# EAGLE schematic duende (EAGLE 7.3.0)
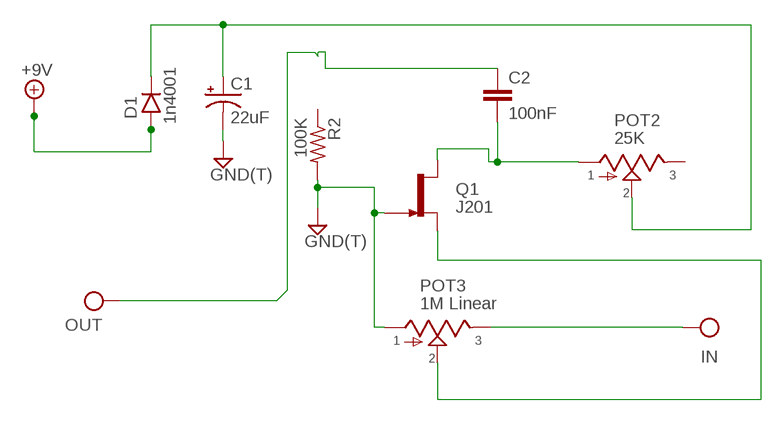
[diagram p0: schematic, sheet 1]

## Parts
+9V  +9V  +9V(T)  [SQUARE]
C1  22uF  050  [050_020]
C2  100nF  070X0302  [070X030]
D1  1n4001  DO41.1  [DO41-1]
GND1  GND(T)  [SQUARE]
GND2  GND(T)  [SQUARE]
IN  IN(T)  [SQUARE]
OUT  OUT(T)  [SQUARE]
POT2  25K  POTTRIM  [B25P]
POT3  1M Linear  POTR  [16MM-ROUND]
Q1  J201  [TO92-]
R2  100K  3MM.3  [R0204/3]

## Nets
+9V: +9V.1(+9V) D1.A
GND: C1.- GND1.1(GND) GND2.1(GND) POT3.1 Q1.1(G)
N$1: POT3.2 Q1.2(S)
N$2: C1.+ POT2.2
N$3: POT3.3
N$4: C2.2 POT2.1 Q1.3(D)
N$5: C2.1
OUT: OUT.1(OUT)
Unconnected: D1.C IN.1(IN) POT2.3 R2.1 R2.2

## Library data of the parts
+9V = gm-supply:+9V(T): +9V Voltage Supply use this to hook up +9v throughout a schematic instead of running wire automatically labels the net "+9v" adds a hookup pad to the circuit board
C1 = gm-caps-electro-pol:050: 0.22 - 100uF Xicon values at Mouser.com: 10V: 10 - 100uF; 16V: 2.2 - 47uF; 25V: 0.47 - 47uF; 50V: 0.22 - 22uF
C2 = gm-caps-film-chicklet:070X030: 0.0001 - .01uF (100 - 10,000pF) Panasonic ECQ-B 7mm x 3mm 50 or 63V: 0.0001 - .01uF (100 - 10,000pF);
D1 = gm-diodes:DO41: DO-41 Package Diodes: 1N4001 - 1N40019 Zener Diodes: 1N4728 - 1N4764
GND1 GND2 = gm-supply:GND(T): Ground use this to hook up ground (GND) throughout a schematic instead of running wire automatically labels the net "GND" adds a hookup pad to the circuit board (you can use several)
IN = gm-supply:IN(T): Input obsolete: use Pad instead and label net shematic input label with circuit board terminal/pad generally used only once on a schematic (because this device labels the net "IN" in the same way as a voltage supply or ground net)
OUT = gm-supply:OUT(T): Output obsolete: use Pad instead and label net output label with circuit board terminal/pad usually appears only once on a schematic
POT2 POT3 = gm-pots:POT: Potentiometers the arrow indicates the clockwise motion of th wiper (lug 2) fully counter clockwise there is no resistance between lugs 1 and 2 fully clockwise the resistance between lugs 1 and 2 is the value of the pot
Q1 = gm-trans:J201: N-channel JFET
R2 = gm-resistors:3MM: 3mm Resistors Leads spaced 1-6 holes apart for 0.1" perfboard. Suitable for 1/8 watt resistors.